# EAGLE design KeyB_1 (EAGLE 7.6.0)
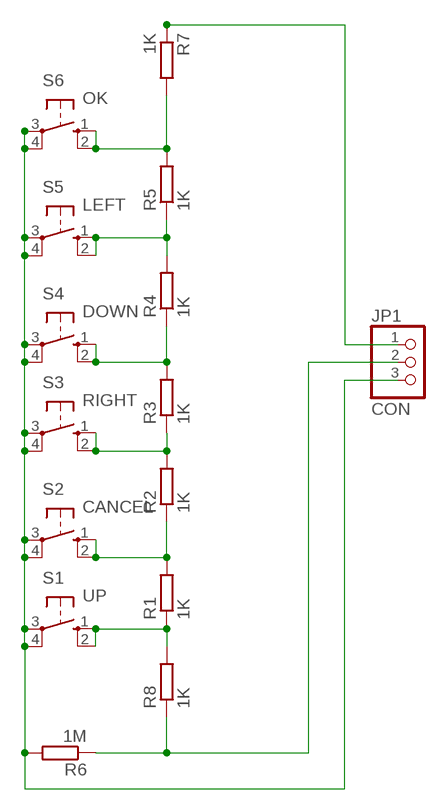
[diagram p0: schematic, sheet 1]

## Parts
JP1  CON  PINHD-1X3  [1X03]
R1  1K  R-EU_R1206W  [R1206W]
R2  1K  R-EU_R1206W  [R1206W]
R3  1K  R-EU_R1206W  [R1206W]
R4  1K  R-EU_R1206W  [R1206W]
R5  1K  R-EU_R1206W  [R1206W]
R6  1M  R-EU_R1206W  [R1206W]
R7  1K  R-EU_R1206W  [R1206W]
R8  1K  R-EU_R1206W  [R1206W]
S1  UP  10-XX  [B3F-10XX]
S2  CANCEL  10-XX  [B3F-10XX]
S3  RIGHT  10-XX  [B3F-10XX]
S4  DOWN  10-XX  [B3F-10XX]
S5  LEFT  10-XX  [B3F-10XX]
S6  OK  10-XX  [B3F-10XX]

## Nets
+5V: JP1.1 R7.1
AN_IN: JP1.3 R6.2 S1.3(P) S1.4(P1) S2.3(P) S2.4(P1) S3.3(P) S3.4(P1) S4.3(P) S4.4(P1) S5.3(P) S5.4(P1) S6.3(P) S6.4(P1)
GND: JP1.2 R6.1 R8.1
N$1: R5.2 R7.2 S6.1(S) S6.2(S1)
N$2: R4.2 R5.1 S5.1(S) S5.2(S1)
N$3: R2.2 R3.1 S3.1(S) S3.2(S1)
N$4: R3.2 R4.1 S4.1(S) S4.2(S1)
N$5: R1.1 R8.2 S1.1(S) S1.2(S1)
N$7: R1.2 R2.1 S2.1(S) S2.2(S1)

## Library data of the parts
JP1 = pinhead:PINHD-1X3: PIN HEADER
R1-R8 = rcl:R-EU_: RESISTOR, European symbol
S1-S6 = switch-omron:10-XX: OMRON SWITCH; MPN: B3F-1000; OC_FARNELL: 176432; OC_NEWARK: 36M3542

## Board
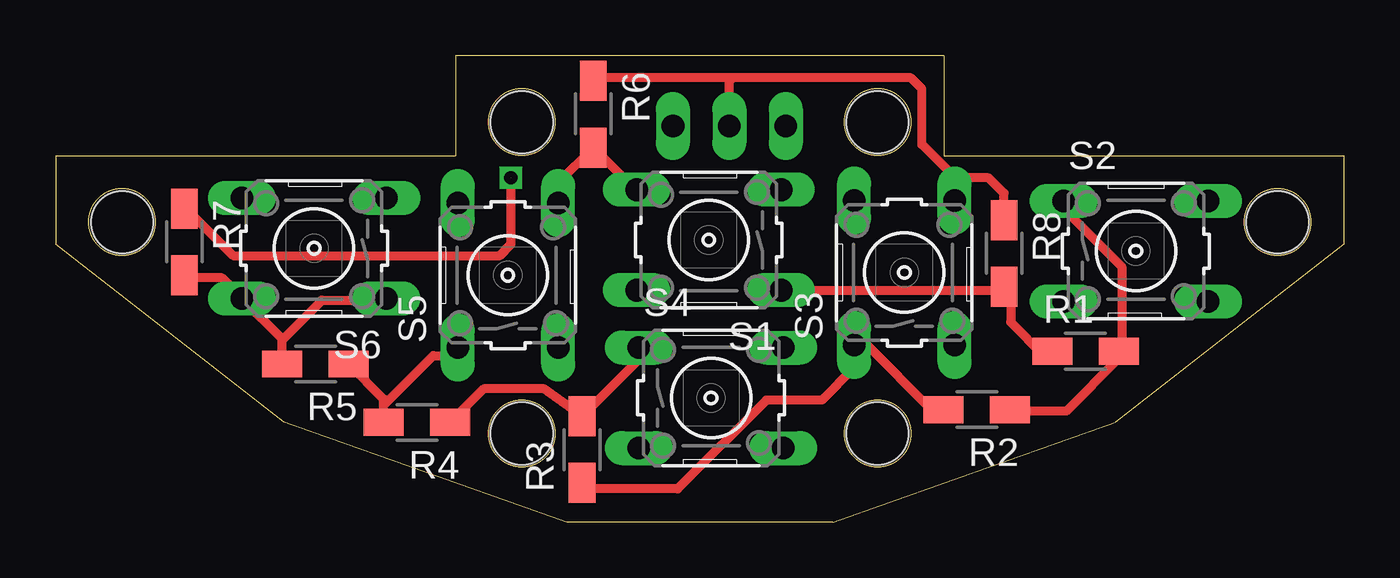
[diagram p1: board, top side]
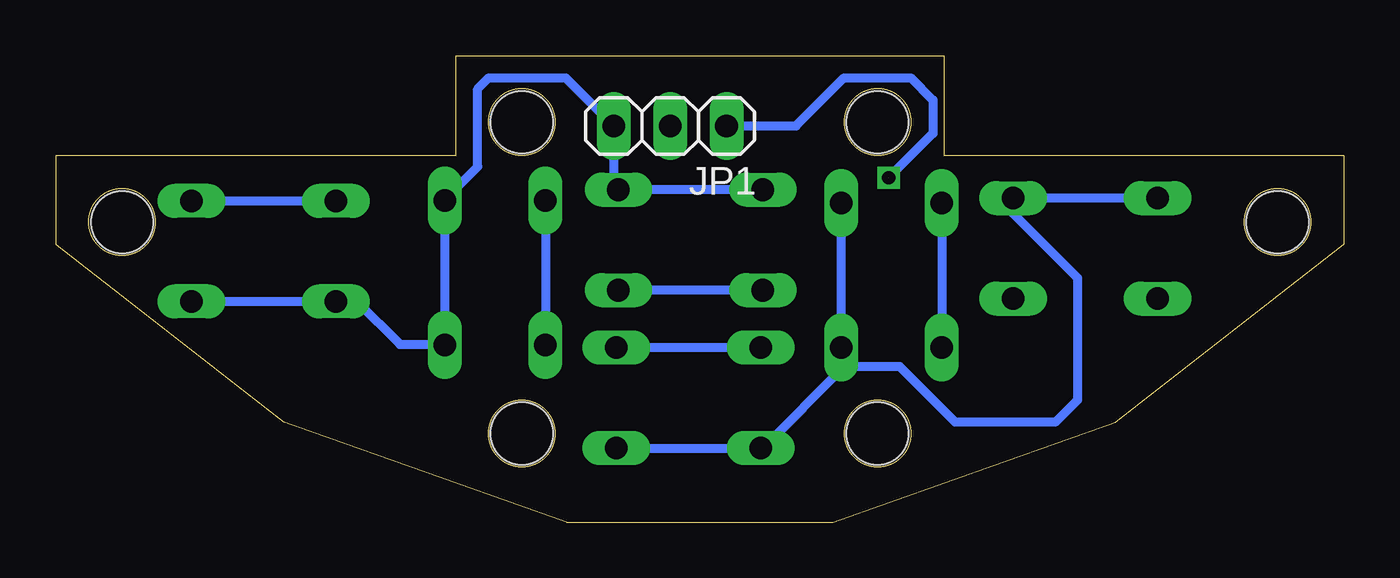
[diagram p2: board, bottom side, seen from below]

Size 58 x 21 mm. Coordinates in mm from the lower left corner, seen from the top.
Outline: 0,16.5 18,16.5 18,21 40,21 40,16.5 58,16.5 58,12.5 47.71,4.5 35,0 23,0 10.29,4.5 0,12.5 0,16.5
Outline: circle at 21,18 radius 1.5
Outline: circle at 37,18 radius 1.5
Outline: circle at 55,13.5 radius 1.5
Outline: circle at 3,13.5 radius 1.5
Outline: circle at 21,4 radius 1.5
Outline: circle at 37,4 radius 1.5
Copper layers (1*16): Top 0.035mm / dielectric 1.5mm / Bottom 0.035mm
Design rules "default": minimum track width 10mil, minimum drill 24mil, track to track 8mil, track to pad 8mil, pad to pad 8mil, via to via 8mil, smd to smd 8mil, copper to edge 40mil, drill to drill 8mil, minimum pad ring 10mil, minimum via ring 8mil, stop-mask expansion 4mil, vias tented up to drill 0mil, thermal gap 10mil
Holes 2.8 mm at 3,13.5 37,18 21,18 37,4 55,13.5 21,4

### Footprints (pad centres in the part's own frame; a part is rotated, then mirrored left to right if it is on the bottom)
1X03 = drill 1.016 long: 1 -2.54,0; 2 0,0; 3 2.54,0
R1206W = smd 1.8 x 1.2: 1 -1.499,0; 2 1.499,0
B3F-10XX = drill 1.016 long: 1 -3.251,2.261; 2 3.251,2.261; 3 -3.251,-2.261; 4 3.251,-2.261

### Placement (x,y rotation side)
JP1  30.34,17.84 180 bottom
R1  46.38,7.69 0 top
R2  41.46,5.07 180 top
R3  23.7,3.28 90 top
R4  16.27,4.5 180 top
R5  11.69,7.12 180 top
R6  24.21,18.36 270 top
R7  5.8,12.61 270 top
R8  42.7,12.09 270 top
S1  29.41,12.7 180 top
S2  48.63,12.2 0 top
S3  38.21,11.23 90 top
S4  29.51,5.6 0 top
S5  20.36,11.12 90 top
S6  11.64,12.33 180 top

### Tracks (layer width: path | path; a pad name or v marks a point on that pad's centre or on a via)
+5V  (1 unrouted)
  Top 0.406: R7.1 5.89,14.11 8,12 20,12 20.5,12.5 20.5,15.5
  Bottom 0.406: JP1.1 24.66,17.84 22.5,20 19.5,20 18.5,19 18.5,17.5 20.5,15.5
AN_IN
  Top 0.406: S1.4 26.11,14.96 R6.2 22.62,15.28 S5.4
  Bottom 0.406: S6.4 S6.3 14.89,13.89 12,11 12,5.5 13,4.5 17.5,4.5 20,7 22.5,7 | S5.4 S5.3 22.5,7.74 22.5,7 | S1.4 S1.3 32.88,15.18 JP1.3 35.04,20 38.5,20 39,19.5 39,16 40.47,14.53 S3.4 S3.3 40.49,8 42.5,8 44.44,9.94 S2.3 S2.4 | S4.4 S4.3 26.16,3.34 22.5,7
GND
  Top 0.406: R8.1 42.7,14.8 42,15.5 40.5,15.5 39,17 39,19.5 38.5,20 30.5,20 | 30.5,20 24.35,20 R6.1 | JP1.2 30.34,19.84 30.5,20
N$1
  Top 0.406: R5.2 10.19,8.26 | 10.19,8.26 S6.2 8.39,10.11 7.5,11 5.91,11 R7.2 | 10.19,8.26 10.26,8.26 12,10 14.82,10 S6.1
N$2
  Top 0.406: S5.1 17.74,7.5 17,7.5 14.77,5.27 R4.2 14.77,5.54 R5.1
  Bottom 0.406: S5.2 S5.1
N$3
  Top 0.406: R2.2 39.44,5.07 36.5,8 35.97,8 S3.1 35.95,6.95 34.5,5.5 32,5.5 28,1.5 23.98,1.5 R3.1
  Bottom 0.406: S3.2 S3.1
N$4
  Top 0.406: S4.1 26.26,7.33 R3.2 23.72,4.78 22,6 19.27,6 R4.1
  Bottom 0.406: S4.1 S4.2
N$5
  Top 0.406: S1.1 42.7,10.44 R8.2 43,10.29 43,9 44.5,7.5 44.68,7.5 R1.1
  Bottom 0.406: S1.2 S1.1
N$7
  Top 0.406: S2.1 45.38,14.12 48,11.5 48,7.82 R1.2 47.88,7.38 45.5,5 43.03,5 R2.1
  Bottom 0.406: S2.2 S2.1
N$8  (via drill 0.6)
  other vias: 20.5,15.5